# Altium project BSPD.PrjPCB (part 2 of 3)
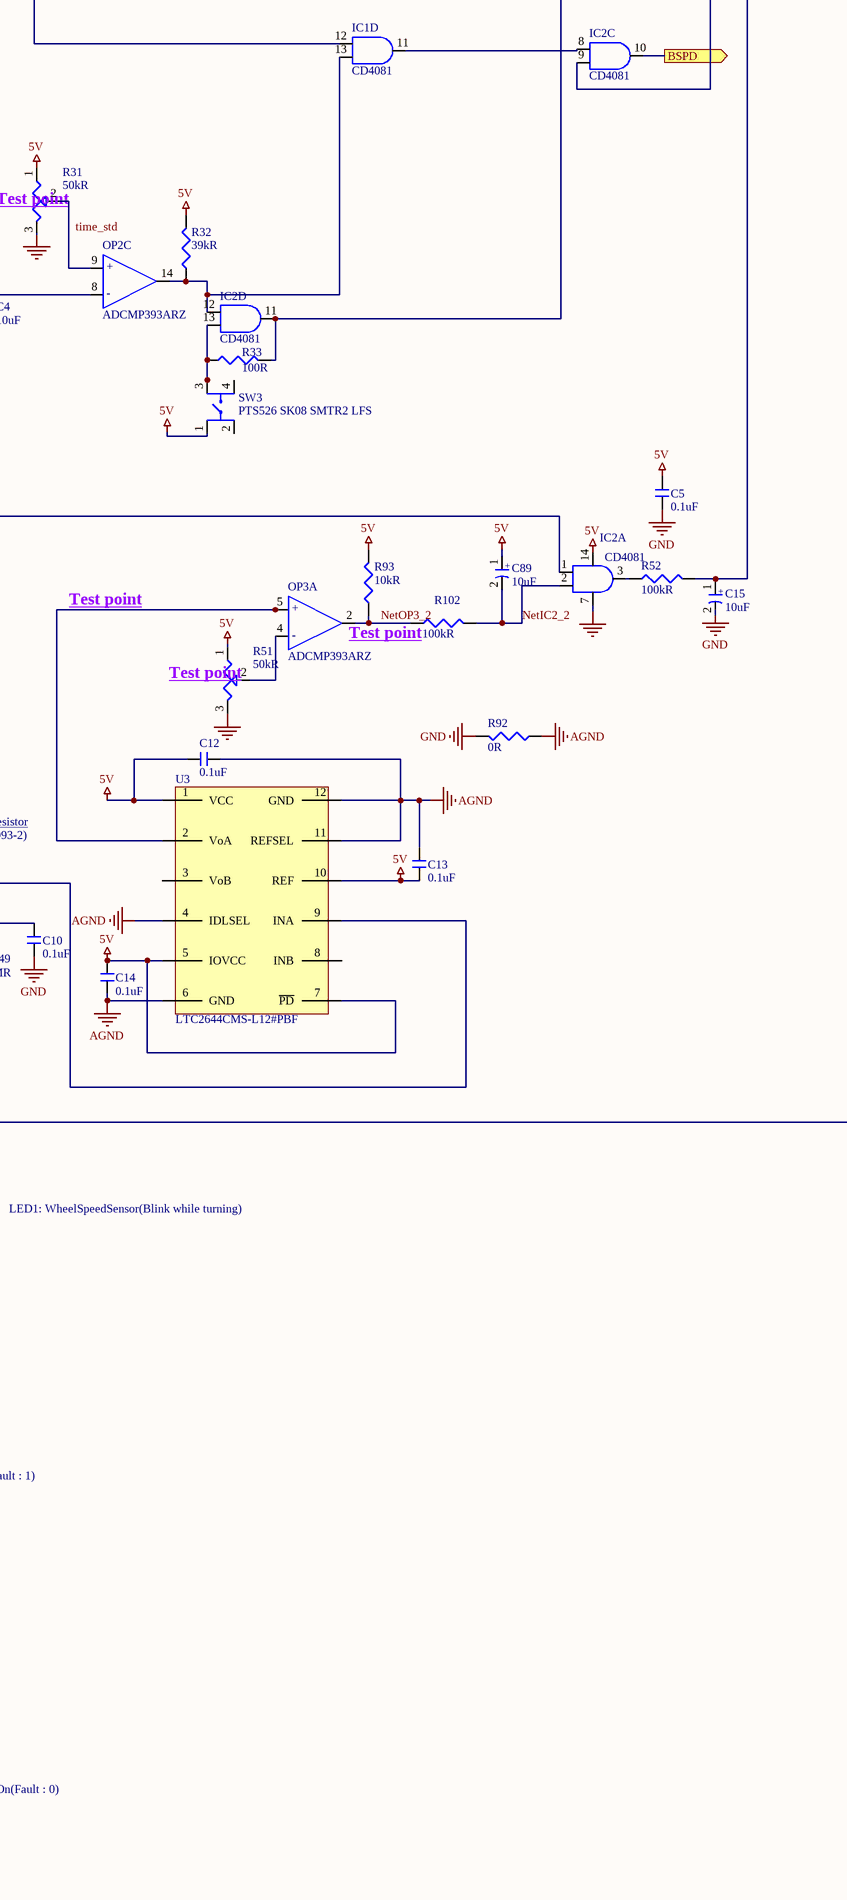
[diagram p4: BSPD+SDC.SchDoc, bottom right]

## Sheet BSPD+SDC.SchDoc (continued)
### Library data of the parts
C1 C2 C5 C6 C9 C10 C12-C14 C18-C20 C23-C26 Copt1 = 0.1uF-C0805C104M5RACTU: Cap Ceramic 0.1uF 50V X7R 10% Pad SMD 0603 Flexible Termination 125C Automotive; Manufacturer: KEMET; Manufacturer Part Number: C0603X104K5RAC3316; Supplier 1: Mouser; Supplier Part Number 1: 80-C0603X104K5R3316; Stock 1: 9731; Pricing 1: 1 = 0.19000, 10 = 0.12700, 100 = 0.06400, 500 = 0.04400, 1000 = 0.03800, 4000 = 0.03700 (USD); ComponentLink1URL: https://www.mouser.tw/ProductDetail/KEMET/C0805C104M5RACTU?qs=VOOUd%252Bza08qHu13WgNByHQ%3D%3D; ComponentLink1Description: Mouser; ComponentLink2Description: Datasheet; ComponentLink2URL: https://www.mouser.tw/datasheet/2/212/KEM_C1002_X7R_SMD-1102033.pdf
C3 C4 C15 C89 = 6.8uF-TAJC685K050RNJ: Cap Tant Solid 6.8uF 50V C CASE 10% (6 X 3.2 X 2.6mm) Inward L SMD 6032-28 1 Ohm 125C T/R; Manufacturer: AVX; Dielectric Material: Tantalum; ESR (Equivalent Series Resistance): 1R; Leakage Current: 3.4uA; Polarity: Polar; Dissipation Factor: 6%; Supplier 1: Mouser; Supplier Part Number 1: 581-TAJC685K050RNJ; Manufacturer Part Number: TAJC685K050RNJ; Stock 1: 13768; Pricing 1: 1 = 1.27000, 10 = 0.96300, 100 = 0.75300, 500 = 0.49500, 1000 = 0.43600, 2500 = 0.42200 (USD); Mount: Surface Mount; Case/Package: Molded; Weight: 0.005291oz; Case Code (Metric): 6032; Case Code (Imperial): 2312; Min Operating Temperature: -55°C; Max Operating Temperature: 125°C; Capacitance: 6.8uF; Tolerance: 10%; Voltage Rating: 50V; Packaging: Tape and Reel; Package Quantity: 1; Termination: SMD/SMT; Voltage Rating (DC): 50V; Features: General Purpose; Length: 6mm; Height: 2.8mm; Width: 0.126inch; Height - Seated (Max): 0.11inch; Depth: 3.2mm; Radiation Hardening: No; REACH SVHC: No SVHC; Lead Free: Lead Free; ComponentLink1URL: https://datasheet.ciiva.com/267/taj-267945.pdf?src-supplier=Digi-Key; ComponentLink1Description: https://datasheet.ciiva.com/267/taj-267945.pdf?src-supplier=Digi-Key; ComponentLink2URL: https://datasheet.ciiva.com/267/taj-267946.pdf?src-supplier=Digi-Key; ComponentLink2Description: https://datasheet.ciiva.com/267/taj-267946.pdf?src-supplier=Digi-Key; ComponentLink3URL: https://datasheet.ciiva.com/267/taj-267947.pdf?src-supplier=Digi-Key; ComponentLink3Description: https://datasheet.ciiva.com/267/taj-267947.pdf?src-supplier=Digi-Key; ComponentLink4URL: https://datasheet.ciiva.com/12910/taj-27497-12910591.pdf?src-supplier=Mouser; ComponentLink4Description: https://datasheet.ciiva.com/12910/taj-27497-12910591.pdf?src-supplier=Mouser; ComponentLink5URL: https://datasheet.ciiva.com/17338/taj-17338791.pdf?src-supplier=Avnet+Europe; ComponentLink5Description: https://datasheet.ciiva.com/17338/taj-17338791.pdf?src-supplier=Avnet+Europe; ComponentLink6URL: http://datasheet.octopart.com/TAJC685K050RNJ-AVX-datasheet-50868559.pdf?src-supplier=AVX; ComponentLink6Description: http://datasheet.octopart.com/TAJC685K050RNJ-AVX-datasheet-50868559.pdf?src-supplier=AVX; ComponentLink7URL: http://datasheet.octopart.com/TAJC685K050RNJ-AVX-datasheet-5313859.pdf?src-supplier=Element14; ComponentLink7Description: http://datasheet.octopart.com/TAJC685K050RNJ-AVX-datasheet-5313859.pdf?src-supplier=Element14; ComponentLink8URL: http://datasheet.octopart.com/TAJC685K050RNJ-AVX-datasheet-78694144.pdf?src-supplier=Element14; ComponentLink8Description: http://datasheet.octopart.com/TAJC685K050RNJ-AVX-datasheet-78694144.pdf?src-supplier=Element14; ComponentLink9URL: http://datasheet.octopart.com/TAJC685K050RNJ-AVX-Interconnect---Elco-datasheet-8359467.pdf; ComponentLink9Description: http://datasheet.octopart.com/TAJC685K050RNJ-AVX-Interconnect---Elco-datasheet-8359467.pdf; ComponentLink10URL: http://datasheet.octopart.com/TAJC685K050RNJ-AVX-Interconnect---Elco-datasheet-8398506.pdf; ComponentLink10Description: http://datasheet.octopart.com/TAJC685K050RNJ-AVX-Interconnect---Elco-datasheet-8398506.pdf; ComponentLink11URL: http://datasheet.octopart.com/TAJC685K050RNJ-AVX-Interconnect---Elco-datasheet-12511273.pdf; ComponentLink11Description: http://datasheet.octopart.com/TAJC685K050RNJ-AVX-Interconnect---Elco-datasheet-12511273.pdf; ComponentLink12URL: http://datasheet.octopart.com/TAJC685K050RNJ-AVX-Interconnect---Elco-datasheet-5308206.pdf?src-supplier=Factory+Futures; ComponentLink12Description: http://datasheet.octopart.com/TAJC685K050RNJ-AVX-Interconnect---Elco-datasheet-5308206.pdf?src-supplier=Factory+Futures; ComponentLink13URL: http://datasheet.octopart.com/TAJC685K050RNJ-AVX-Interconnect---Elco-datasheet-5393561.pdf?src-supplier=Factory+Futures; ComponentLink13Description: http://datasheet.octopart.com/TAJC685K050RNJ-AVX-Interconnect---Elco-datasheet-5393561.pdf?src-supplier=Factory+Futures; ComponentLink14URL: http://datasheet.octopart.com/TAJC685K050RNJ-AVX-Interconnect---Elco-datasheet-5428838.pdf?src-supplier=Factory+Futures; ComponentLink14Description: http://datasheet.octopart.com/TAJC685K050RNJ-AVX-Interconnect---Elco-datasheet-5428838.pdf?src-supplier=Factory+Futures; ComponentLink15URL: http://datasheet.octopart.com/TAJC685K050RNJ-AVX-Interconnect---Elco-datasheet-8324253.pdf?src-supplier=Factory+Futures; ComponentLink15Description: http://datasheet.octopart.com/TAJC685K050RNJ-AVX-Interconnect---Elco-datasheet-8324253.pdf?src-supplier=Factory+Futures; ComponentLink16URL: http://datasheet.octopart.com/TAJC685K050RNJ-AVX-Interconnect---Elco-datasheet-8447299.pdf?src-supplier=Factory+Futures; ComponentLink16Description: http://datasheet.octopart.com/TAJC685K050RNJ-AVX-Interconnect---Elco-datasheet-8447299.pdf?src-supplier=Factory+Futures; ComponentLink17URL: http://datasheet.octopart.com/TAJC685K050RNJ-AVX-Interconnect---Elco-datasheet-8621976.pdf?src-supplier=Factory+Futures; ComponentLink17Description: http://datasheet.octopart.com/TAJC685K050RNJ-AVX-Interconnect---Elco-datasheet-8621976.pdf?src-supplier=Factory+Futures; ComponentLink18URL: http://datasheet.octopart.com/TAJC685K050RNJ-AVX-Interconnect---Elco-datasheet-8701730.pdf?src-supplier=Factory+Futures; ComponentLink18Description: http://datasheet.octopart.com/TAJC685K050RNJ-AVX-Interconnect---Elco-datasheet-8701730.pdf?src-supplier=Factory+Futures; ComponentLink19URL: http://datasheet.octopart.com/TAJC685K050RNJ-AVX-Interconnect---Elco-datasheet-8715220.pdf?src-supplier=Factory+Futures; ComponentLink19Description: http://datasheet.octopart.com/TAJC685K050RNJ-AVX-Interconnect---Elco-datasheet-8715220.pdf?src-supplier=Factory+Futures; ComponentLink20URL: http://datasheet.octopart.com/TAJC685K050RNJ-AVX-Interconnect---Elco-datasheet-8836325.pdf?src-supplier=Factory+Futures; ComponentLink20Description: http://datasheet.octopart.com/TAJC685K050RNJ-AVX-Interconnect---Elco-datasheet-8836325.pdf?src-supplier=Factory+Futures; ComponentLink21URL: http://datasheet.octopart.com/TAJC685K050RNJ-AVX-Interconnect---Elco-datasheet-8853265.pdf?src-supplier=Factory+Futures; ComponentLink21Description: http://datasheet.octopart.com/TAJC685K050RNJ-AVX-Interconnect---Elco-datasheet-8853265.pdf?src-supplier=Factory+Futures; ComponentLink22URL: http://datasheet.octopart.com/TAJC685K050RNJ-AVX-Interconnect---Elco-datasheet-8858887.pdf?src-supplier=Factory+Futures; ComponentLink22Description: http://datasheet.octopart.com/TAJC685K050RNJ-AVX-Interconnect---Elco-datasheet-8858887.pdf?src-supplier=Factory+Futures; ComponentLink23URL: http://datasheet.octopart.com/TAJC685K050RNJ-AVX-Interconnect---Elco-datasheet-8877386.pdf?src-supplier=Factory+Futures; ComponentLink23Description: http://datasheet.octopart.com/TAJC685K050RNJ-AVX-Interconnect---Elco-datasheet-8877386.pdf?src-supplier=Factory+Futures; ComponentLink24URL: http://datasheet.octopart.com/TAJC685K050RNJ-AVX-Interconnect---Elco-datasheet-10028080.pdf?src-supplier=Factory+Futures; ComponentLink24Description: http://datasheet.octopart.com/TAJC685K050RNJ-AVX-Interconnect---Elco-datasheet-10028080.pdf?src-supplier=Factory+Futures; ComponentLink25URL: http://datasheet.octopart.com/TAJC685K050RNJ-AVX-Interconnect---Elco-datasheet-10193294.pdf?src-supplier=Factory+Futures; ComponentLink25Description: http://datasheet.octopart.com/TAJC685K050RNJ-AVX-Interconnect---Elco-datasheet-10193294.pdf?src-supplier=Factory+Futures; ComponentLink26URL: http://datasheet.octopart.com/TAJC685K050RNJ-AVX-Interconnect---Elco-datasheet-10285639.pdf?src-supplier=Factory+Futures; ComponentLink26Description: http://datasheet.octopart.com/TAJC685K050RNJ-AVX-Interconnect---Elco-datasheet-10285639.pdf?src-supplier=Factory+Futures; ComponentLink27URL: http://datasheet.octopart.com/TAJC685K050RNJ-AVX-Interconnect---Elco-datasheet-10380087.pdf?src-supplier=Factory+Futures; ComponentLink27Description: http://datasheet.octopart.com/TAJC685K050RNJ-AVX-Interconnect---Elco-datasheet-10380087.pdf?src-supplier=Factory+Futures; ComponentLink28URL: http://datasheet.octopart.com/TAJC685K050RNJ-AVX-Interconnect---Elco-datasheet-10403705.pdf?src-supplier=Factory+Futures; ComponentLink28Description: http://datasheet.octopart.com/TAJC685K050RNJ-AVX-Interconnect---Elco-datasheet-10403705.pdf?src-supplier=Factory+Futures; ComponentLink29URL: http://datasheet.octopart.com/TAJC685K050RNJ-AVX-Interconnect---Elco-datasheet-10545425.pdf?src-supplier=Factory+Futures; ComponentLink29Description: http://datasheet.octopart.com/TAJC685K050RNJ-AVX-Interconnect---Elco-datasheet-10545425.pdf?src-supplier=Factory+Futures; ComponentLink30URL: http://datasheet.octopart.com/TAJC685K050RNJ-AVX-Interconnect---Elco-datasheet-10620092.pdf?src-supplier=Factory+Futures; ComponentLink30Description: http://datasheet.octopart.com/TAJC685K050RNJ-AVX-Interconnect---Elco-datasheet-10620092.pdf?src-supplier=Factory+Futures; ComponentLink31URL: http://datasheet.octopart.com/TAJC685K050RNJ-AVX-Interconnect---Elco-datasheet-10839255.pdf?src-supplier=Factory+Futures; ComponentLink31Description: http://datasheet.octopart.com/TAJC685K050RNJ-AVX-Interconnect---Elco-datasheet-10839255.pdf?src-supplier=Factory+Futures; ComponentLink32URL: http://datasheet.octopart.com/TAJC685K050RNJ-AVX-Interconnect---Elco-datasheet-10851837.pdf?src-supplier=Factory+Futures; ComponentLink32Description: http://datasheet.octopart.com/TAJC685K050RNJ-AVX-Interconnect---Elco-datasheet-10851837.pdf?src-supplier=Factory+Futures; ComponentLink33URL: http://datasheet.octopart.com/TAJC685K050RNJ-AVX-Interconnect---Elco-datasheet-10916590.pdf?src-supplier=Factory+Futures; ComponentLink33Description: http://datasheet.octopart.com/TAJC685K050RNJ-AVX-Interconnect---Elco-datasheet-10916590.pdf?src-supplier=Factory+Futures; ComponentLink34URL: http://datasheet.octopart.com/TAJC685K050RNJ-AVX-Interconnect---Elco-datasheet-11475269.pdf?src-supplier=Factory+Futures; ComponentLink34Description: http://datasheet.octopart.com/TAJC685K050RNJ-AVX-Interconnect---Elco-datasheet-11475269.pdf?src-supplier=Factory+Futures; ComponentLink35URL: http://datasheet.octopart.com/TAJC685K050RNJ-AVX-datasheet-48507738.pdf?src-supplier=Future+Electronics; ComponentLink35Description: http://datasheet.octopart.com/TAJC685K050RNJ-AVX-datasheet-48507738.pdf?src-supplier=Future+Electronics; ComponentLink36URL: http://datasheet.octopart.com/TAJC685K050RNJ-AVX-datasheet-66442782.pdf?src-supplier=Newark; ComponentLink36Description: http://datasheet.octopart.com/TAJC685K050RNJ-AVX-datasheet-66442782.pdf?src-supplier=Newark; ComponentLink37URL: http://datasheet.octopart.com/TAJC685K050RNJ-AVX-datasheet-62304617.pdf?src-supplier=Farnell; ComponentLink37Description: http://datasheet.octopart.com/TAJC685K050RNJ-AVX-datasheet-62304617.pdf?src-supplier=Farnell; ComponentLink38URL: http://datasheet.octopart.com/TAJ-Series---Standard-Tantalum-AVX-datasheet-family-88.pdf; ComponentLink38Description: http://datasheet.octopart.com/TAJ-Series---Standard-Tantalum-AVX-datasheet-family-88.pdf
C7 C11 = 1206 100nF (104) 10% 50V: 贴片电容; Package: 1206; Supplier: LC; SuppliersPartNumber: C24497
  C11: ComponentLink1Description: 供应商链接; ComponentLink1URL: http://www.szlcsc.com/product/details_25237.html
C8 = 1206 470pF (471) 10% 50V: 贴片电容; ComponentLink1Description: 供应商链接; ComponentLink1URL: http://www.szlcsc.com/product/details_2220.html; Package: 1206; Supplier: LC; SuppliersPartNumber: C1868
C16 = 1uF-0805DC105KAT2A: Cap Cer 0805 1uF 25V X7R 10%; Manufacturer: KEMET; Manufacturer Part Number: C0805C474K3REC7210; Supplier 1: Mouser; Stock 1: 9935; Pricing 1: 1 = 0.30000, 10 = 0.14000, 100 = 0.09000, 500 = 0.08000, 1000 = 0.07000, 2000 = 0.06000 (USD); Supplier Part Number 1: 80-C0805C474K3RECLR; ComponentLink2Description: Mouser; ComponentLink2URL: https://www.mouser.tw/ProductDetail/AVX/0805DC105KAT2A?qs=ZBeOGGPQgEHtAr%2F2DCpkLA%3D%3D
C17 = 0.47uF-C0805C474K3REC7210: Cap Cer 0805 470NF 25V X7R 10%; Manufacturer: KEMET; Supplier 1: Mouser; Manufacturer Part Number: C0805C474K3REC7210; Stock 1: 9935; Pricing 1: 1 = 0.30000, 10 = 0.14000, 100 = 0.09000, 500 = 0.08000, 1000 = 0.07000, 2000 = 0.06000 (USD); ComponentLink1URL: https://api.kemet.com/component-edge/download/datasheet/C0805C474K3REC7210.pdf?src-supplier=Digi-Key; ComponentLink1Description: https://api.kemet.com/component-edge/download/datasheet/C0805C474K3REC7210.pdf?src-supplier=Digi-Key; Supplier Part Number 1: 80-C0805C474K3RECLR
C27 = UPM1J221MHD1TO: Cap Aluminum 220uF 63V 20% (12.5 X 20mm) Radial 7.5mm 835mA 5000h 105°C Ammo Pack; Manufacturer: Nichicon; Dielectric Material: Aluminium; Impedance: 65mR; Life (Hours): 5000Hour; Leakage Current: 415.8uA; Dissipation Factor: 0.08%; Lead Diameter: 0.6mm; Supplier 1: Mouser; Supplier Part Number 1: 647-UPM1J221MHD1TO; Manufacturer Part Number: UPM1J221MHD1TO; Stock 1: 485; Pricing 1: 1 = 0.84000, 10 = 0.63700, 50 = 0.53000, 100 = 0.45600, 1000 = 0.30300, 10000 = 0.26900 (USD); Mount: Through Hole; Case/Package: Radial; Number of Pins: 2; Min Operating Temperature: -55°C; Max Operating Temperature: 105°C; Capacitance: 220uF; Tolerance: 20%; Voltage Rating: 63V; Ripple Current: 835mA; Package Quantity: 1; Packaging: Tape and Reel; Voltage Rating (DC): 63V; Termination: Radial; Voltage: 63V; Series: PM; Construction: RADIAL; Diameter: 12.5mm; Length: 20mm; Height: 20mm; Lead Pitch: 5mm; Height - Seated (Max): 0.866inch; Radiation Hardening: No; REACH SVHC: No SVHC; Lead Free: Lead Free; RoHS Compliant: Yes; ComponentLink1URL: https://datasheet.ciiva.com/6136/e-pm-6136976.pdf?src-supplier=Farnell; ComponentLink1Description: https://datasheet.ciiva.com/6136/e-pm-6136976.pdf?src-supplier=Farnell; ComponentLink2URL: https://datasheet.ciiva.com/16289/e-pm-16289237.pdf?src-supplier=Future+Electronics; ComponentLink2Description: https://datasheet.ciiva.com/16289/e-pm-16289237.pdf?src-supplier=Future+Electronics; ComponentLink3URL: https://datasheet.ciiva.com/29547/e-pm-29547336.pdf?src-supplier=Digi-Key; ComponentLink3Description: https://datasheet.ciiva.com/29547/e-pm-29547336.pdf?src-supplier=Digi-Key; ComponentLink4URL: https://datasheet.ciiva.com/14604/70187696-14604329.pdf?src-supplier=Allied+Electronics; ComponentLink4Description: https://datasheet.ciiva.com/14604/70187696-14604329.pdf?src-supplier=Allied+Electronics; ComponentLink5URL: https://datasheet.ciiva.com/29547/e-pm-29547337.pdf?src-supplier=Digi-Key; ComponentLink5Description: https://datasheet.ciiva.com/29547/e-pm-29547337.pdf?src-supplier=Digi-Key; ComponentLink6URL: https://datasheet.ciiva.com/7907/e-pm-7907421.pdf?src-supplier=Element14; ComponentLink6Description: https://datasheet.ciiva.com/7907/e-pm-7907421.pdf?src-supplier=Element14; ComponentLink7URL: https://datasheet.ciiva.com/11684/e-pm-11684319.pdf?src-supplier=Avnet; ComponentLink7Description: https://datasheet.ciiva.com/11684/e-pm-11684319.pdf?src-supplier=Avnet; ComponentLink8URL: http://datasheet.octopart.com/UPM1J221MHD1TO-Nichicon-datasheet-8702619.pdf?src-supplier=Element14; ComponentLink8Description: http://datasheet.octopart.com/UPM1J221MHD1TO-Nichicon-datasheet-8702619.pdf?src-supplier=Element14; ComponentLink9URL: http://datasheet.octopart.com/UPM1J221MHD1TO-Nichicon-datasheet-41194115.pdf?src-supplier=Farnell; ComponentLink9Description: http://datasheet.octopart.com/UPM1J221MHD1TO-Nichicon-datasheet-41194115.pdf?src-supplier=Farnell; ComponentLink10URL: http://datasheet.octopart.com/UPM1J221MHD1TO-Nichicon-datasheet-12512882.pdf?src-supplier=Element14; ComponentLink10Description: http://datasheet.octopart.com/UPM1J221MHD1TO-Nichicon-datasheet-12512882.pdf?src-supplier=Element14; ComponentLink11URL: http://datasheet.octopart.com/UPM1J221MHD1TO-Nichicon-datasheet-8835184.pdf?src-supplier=Element14; ComponentLink11Description: http://datasheet.octopart.com/UPM1J221MHD1TO-Nichicon-datasheet-8835184.pdf?src-supplier=Element14; ComponentLink12URL: http://datasheet.octopart.com/UPM1J221MHD1TO-Nichicon-datasheet-538736.pdf?src-supplier=Future+Electronics; ComponentLink12Description: http://datasheet.octopart.com/UPM1J221MHD1TO-Nichicon-datasheet-538736.pdf?src-supplier=Future+Electronics; ComponentLink13URL: http://datasheet.octopart.com/UPM1J221MHD1TO-Nichicon-datasheet-5316055.pdf?src-supplier=Element14; ComponentLink13Description: http://datasheet.octopart.com/UPM1J221MHD1TO-Nichicon-datasheet-5316055.pdf?src-supplier=Element14; ComponentLink14URL: http://datasheet.octopart.com/UPM1J221MHD1TO-Nichicon-datasheet-41169139.pdf?src-supplier=Element14; ComponentLink14Description: http://datasheet.octopart.com/UPM1J221MHD1TO-Nichicon-datasheet-41169139.pdf?src-supplier=Element14
D1-D6 D10-D13 = 1N4148W-TP: 1N4148W Series 100 V 150 mA 4 ns SMT High Speed Switching Diode - SOD-123; Manufacturer: MCC; Max Surge Current: 2A; Forward Voltage: 1V; Forward Current: 150mA; Recovery Time: 4ns; Max Reverse Leakage Current: 5uA; Max Repetitive Reverse Voltage (Vrrm): 100V; Power Dissipation: 400mW; Max Forward Surge Current (Ifsm): 1A; Element Configuration: Single; Polarity: Standard; Capacitance: 4pF; Supplier 1: Digi-Key; Supplier Part Number 1: 1N4148WTPMSCT-ND; Manufacturer Part Number: 1N4148W-TP; Stock 1: 726390; Pricing 1: 1 = 0.10000, 10 = 0.08100, 100 = 0.03400, 500 = 0.02670, 1000 = 0.01854 (USD); Mount: Surface Mount; Number of Pins: 2; Min Operating Temperature: -65°C; Max Operating Temperature: 150°C; Packaging: Tape and Reel; Package Quantity: 3000; Average Rectified Current: 150mA; Reverse Recovery Time: 4ns; Peak Non-Repetitive Surge Current: 2A; Voltage Rating (DC): 100V; Current Rating: 150mA; Output Current: 150mA; Max Reverse Voltage (DC): 100V; Length: 2.85mm; Height: 1.2mm; Width: 1.8mm; Radiation Hardening: No; REACH SVHC: Unknown; Lead Free: Lead Free; ComponentLink1URL: https://datasheet.ciiva.com/1243/1684829-1243908.pdf?src-supplier=Newark; ComponentLink1Description: https://datasheet.ciiva.com/1243/1684829-1243908.pdf?src-supplier=Newark; ComponentLink2URL: https://datasheet.ciiva.com/16836/1n4148wsod123-16836277.pdf?src-supplier=Future+Electronics; ComponentLink2Description: https://datasheet.ciiva.com/16836/1n4148wsod123-16836277.pdf?src-supplier=Future+Electronics; ComponentLink3URL: https://datasheet.ciiva.com/4435/1n4148wsod123-48460-4435223.pdf?src-supplier=Mouser; ComponentLink3Description: https://datasheet.ciiva.com/4435/1n4148wsod123-48460-4435223.pdf?src-supplier=Mouser; ComponentLink4URL: https://datasheet.ciiva.com/14557/70055519-14557767.pdf?src-supplier=Allied+Electronics; ComponentLink4Description: https://datasheet.ciiva.com/14557/70055519-14557767.pdf?src-supplier=Allied+Electronics; ComponentLink5URL: https://datasheet.ciiva.com/911/1n4148wsod123-911676.pdf?src-supplier=Digi-Key; ComponentLink5Description: https://datasheet.ciiva.com/911/1n4148wsod123-911676.pdf?src-supplier=Digi-Key; ComponentLink6URL: https://datasheet.ciiva.com/7622/1684829-7622556.pdf?src-supplier=Element14; ComponentLink6Description: https://datasheet.ciiva.com/7622/1684829-7622556.pdf?src-supplier=Element14; ComponentLink7URL: https://datasheet.ciiva.com/911/1n4148wsod123-911677.pdf?src-supplier=Digi-Key; ComponentLink7Description: https://datasheet.ciiva.com/911/1n4148wsod123-911677.pdf?src-supplier=Digi-Key; ComponentLink8URL: https://datasheet.ciiva.com/911/1n4148wsod123-911678.pdf?src-supplier=Digi-Key; ComponentLink8Description: https://datasheet.ciiva.com/911/1n4148wsod123-911678.pdf?src-supplier=Digi-Key; ComponentLink9URL: https://datasheet.ciiva.com/22747/1684829-22747439.pdf?src-supplier=Element14; ComponentLink9Description: https://datasheet.ciiva.com/22747/1684829-22747439.pdf?src-supplier=Element14; ComponentLink10URL: http://datasheet.octopart.com/1N4148W-TP-Micro-Commercial-datasheet-60845.pdf?src-supplier=Element14; ComponentLink10Description: http://datasheet.octopart.com/1N4148W-TP-Micro-Commercial-datasheet-60845.pdf?src-supplier=Element14; ComponentLink11URL: http://datasheet.octopart.com/1N4148W-TP-MCC-datasheet-8327246.pdf?src-supplier=Future+Electronics; ComponentLink11Description: http://datasheet.octopart.com/1N4148W-TP-MCC-datasheet-8327246.pdf?src-supplier=Future+Electronics; ComponentLink12URL: http://datasheet.octopart.com/1N4148W-TP-MCC-datasheet-124568.pdf?src-supplier=Future+Electronics; ComponentLink12Description: http://datasheet.octopart.com/1N4148W-TP-MCC-datasheet-124568.pdf?src-supplier=Future+Electronics; ComponentLink13URL: http://datasheet.octopart.com/1N4148W-TP-MCC-datasheet-10003094.pdf?src-supplier=Allied+Electronics; ComponentLink13Description: http://datasheet.octopart.com/1N4148W-TP-MCC-datasheet-10003094.pdf?src-supplier=Allied+Electronics; ComponentLink14URL: http://datasheet.octopart.com/1N4148W-TP-Micro-Commercial-datasheet-11773887.pdf?src-supplier=Arrow; ComponentLink14Description: http://datasheet.octopart.com/1N4148W-TP-Micro-Commercial-datasheet-11773887.pdf?src-supplier=Arrow; ComponentLink15URL: http://datasheet.octopart.com/1N4148W-TP-Micro-Commercial-datasheet-13551187.pdf?src-supplier=Future+Electronics; ComponentLink15Description: http://datasheet.octopart.com/1N4148W-TP-Micro-Commercial-datasheet-13551187.pdf?src-supplier=Future+Electronics; ComponentLink16URL: http://datasheet.octopart.com/1N4148W-TP-MCC-datasheet-133511570.pdf?src-supplier=Future+Electronics; ComponentLink16Description: http://datasheet.octopart.com/1N4148W-TP-MCC-datasheet-133511570.pdf?src-supplier=Future+Electronics; ComponentLink17URL: http://datasheet.octopart.com/1N4148W-TP-MCC-datasheet-134792309.pdf?src-supplier=TME; ComponentLink17Description: http://datasheet.octopart.com/1N4148W-TP-MCC-datasheet-134792309.pdf?src-supplier=TME; Supplier 2: Mouser; Supplier Part Number 2: 833-1N4148W-TP
D7-D9 = 1SS355VMFHTE-17: ROHM         1SS355VMFHTE-17             Small Signal Diode, Single, 90 V, 100 mA, 1.2 V, 4 ns, 500 mA; Max Repetitive Reverse Voltage (Vrrm): 90V; Forward Current: 100mA; Forward Voltage: 1.2V; Reverse Recovery Time: 4ns; Max Forward Surge Current (Ifsm): 500mA; Supplier 1: Mouser; Supplier Part Number 1: 755-1SS355VMFHTE-17; Manufacturer: Rohm; Manufacturer Part Number: 1SS355VMFHTE-17; RoHS: No; Stock 1: 46949; Pricing 1: 1 = 0.31000, 10 = 0.21200, 100 = 0.08900, 1000 = 0.06000, 3000 = 0.04700, 9000 = 0.04700 (USD); Case/Package: SOD; Number of Pins: 2; Max Operating Temperature: 150°C; Packaging: Cut Tape; Element Configuration: Single; REACH SVHC: Unknown; ComponentLink1URL: http://www.farnell.com/datasheets/2296360.pdf?src-supplier=Farnell; ComponentLink1Description: http://www.farnell.com/datasheets/2296360.pdf?src-supplier=Farnell; ComponentLink2URL: http://www.farnell.com/datasheets/2021474.pdf?src-supplier=Farnell; ComponentLink2Description: http://www.farnell.com/datasheets/2021474.pdf?src-supplier=Farnell; ComponentLink3URL: https://www.rohm.com/datasheet/1SS355VMFH/1ss355vmfhte-17-e?src-supplier=Digi-Key; ComponentLink3Description: https://www.rohm.com/datasheet/1SS355VMFH/1ss355vmfhte-17-e?src-supplier=Digi-Key; ComponentLink4URL: http://www.farnell.com/datasheets/2296360.pdf?src-supplier=Newark; ComponentLink4Description: http://www.farnell.com/datasheets/2296360.pdf?src-supplier=Newark; ComponentLink5URL: http://www.farnell.com/datasheets/2021474.pdf?src-supplier=Element14; ComponentLink5Description: http://www.farnell.com/datasheets/2021474.pdf?src-supplier=Element14; catagory: diode
H1 = 34830-2002: MX150 2x10 Dual Row Right-Angle Header, 20 Circuits, Keying Option B, Light Gray, Solder Tail; Manufacturer: Molex; Gender: Male; Number of Circuits: 20; Pitch: 3.5mm; Glow Wire Compliant: Non-compliant; Supplier 1: Mouser; Supplier Part Number 1: 538-34830-2002; Manufacturer Part Number: 34830-2002; Stock 1: 153; Pricing 1: 1 = 8.15000, 10 = 7.09000, 50 = 7.09000, 100 = 5.85000, 1000 = 5.21000, 10000 = 5.21000 (USD); Mount: Through Hole; Number of Pins: 20; Material: Copper Alloy; Contact Plating: Nickel; Packaging: Tray; Orientation: Right Angle; Number of Rows: 2; Termination: Solder; Halogen Free: Low Halogen; ELV: Compliant; ComponentLink1URL: http://datasheet.octopart.com/34830-2002-Molex-datasheet-16362846.pdf?src-supplier=Molex; ComponentLink1Description: http://datasheet.octopart.com/34830-2002-Molex-datasheet-16362846.pdf?src-supplier=Molex; ComponentLink2URL: http://sigma.octopart.com/16362845/technical_drawing/Molex-34830-2002.pdf?src-supplier=Molex; ComponentLink2Description: http://sigma.octopart.com/16362845/technical_drawing/Molex-34830-2002.pdf?src-supplier=Molex
H2 = 34830-0801: MX150 2x4 Dual Row Right-Angle Header, 8 Circuits, Keying Option A, Black, Solder Tail; Manufacturer: Molex; Gender: Male; Number of Circuits: 8; Pitch: 3.5mm; Glow Wire Compliant: Non-compliant; Supplier 1: Mouser; Supplier Part Number 1: 538-34830-0801; Manufacturer Part Number: 34830-0801; Stock 1: 31; Pricing 1: 1 = 4.90000, 10 = 4.32000, 50 = 4.32000, 100 = 3.44000, 1000 = 2.89000, 10000 = 2.80000 (USD); Mount: Through Hole; Material: Copper Alloy; Contact Plating: Nickel; Termination: Solder; Packaging: Tray; Orientation: Right Angle; Number of Rows: 2; Halogen Free: Low Halogen; ELV: Compliant; ComponentLink1URL: http://datasheet.octopart.com/34830-0801-Molex-datasheet-16362832.pdf?src-supplier=Molex; ComponentLink1Description: http://datasheet.octopart.com/34830-0801-Molex-datasheet-16362832.pdf?src-supplier=Molex; ComponentLink2URL: http://sigma.octopart.com/16362835/technical_drawing/Molex-34830-0801.pdf?src-supplier=Molex; ComponentLink2Description: http://sigma.octopart.com/16362835/technical_drawing/Molex-34830-0801.pdf?src-supplier=Molex; ComponentLink3URL: http://datasheet.octopart.com/34830-0801-Molex-datasheet-120147758.pdf?src-supplier=Allied+Electronics; ComponentLink3Description: http://datasheet.octopart.com/34830-0801-Molex-datasheet-120147758.pdf?src-supplier=Allied+Electronics; ComponentLink4URL: http://datasheet.octopart.com/34830-0801-Molex-datasheet-140182486.pdf?src-supplier=Allied+Electronics; ComponentLink4Description: http://datasheet.octopart.com/34830-0801-Molex-datasheet-140182486.pdf?src-supplier=Allied+Electronics
H3 = 0367831201: MX120G Sealed Header Connector Assembly, 12 Circuit, Color Mark Identification Black; Manufacturer: Molex; Number of Positions: 12; Connector Type: Male Pin; Pitch: 0.126inch; Row Spacing: 0.233inch; Supplier 1: Mouser; Supplier Part Number 1: 538-36783-1201; Manufacturer Part Number: 0367831201; Stock 1: 569; Pricing 1: 1 = 1.45000, 10 = 1.20000, 50 = 1.20000, 100 = 1.05000, 1000 = 0.81300, 10000 = 0.65700 (USD); Mount: Through Hole; Color: Black; Contact Plating: Tin; Contact Material: Brass; Housing Color: Black; Housing Material: Nylon; Min Operating Temperature: -40°C; Max Operating Temperature: 105°C; Number of Rows: 2; Fastening Type: Ramp; Packaging: Bulk; Termination: Solder; Number of Contacts: 12; Orientation: Right Angle; Series: MX120G™ 36783; Contact Type: Male Pin; Length: 37.3mm; Radiation Hardening: No; Lead Free: Lead Free; RoHS Compliant: Yes; ComponentLink1URL: https://datasheet.ciiva.com/6814/367831201-sd-6814032.pdf?src-supplier=Digi-Key; ComponentLink1Description: https://datasheet.ciiva.com/6814/367831201-sd-6814032.pdf?src-supplier=Digi-Key; ComponentLink2URL: http://datasheet.octopart.com/0367831201-Molex-datasheet-16367546.pdf?src-supplier=Molex; ComponentLink2Description: http://datasheet.octopart.com/0367831201-Molex-datasheet-16367546.pdf?src-supplier=Molex; ComponentLink3URL: http://datasheet.octopart.com/36783-1201-Molex-datasheet-13268039.pdf?src-supplier=Molex; ComponentLink3Description: http://datasheet.octopart.com/36783-1201-Molex-datasheet-13268039.pdf?src-supplier=Molex; ComponentLink4URL: http://datasheet.octopart.com/36783-1201-Molex-datasheet-34442202.pdf?src-supplier=Farnell; ComponentLink4Description: http://datasheet.octopart.com/36783-1201-Molex-datasheet-34442202.pdf?src-supplier=Farnell; ComponentLink5URL: http://datasheet.octopart.com/36783-1201-Molex-datasheet-41568726.pdf?src-supplier=Element14; ComponentLink5Description: http://datasheet.octopart.com/36783-1201-Molex-datasheet-41568726.pdf?src-supplier=Element14; ComponentLink6URL: http://datasheet.octopart.com/36783-1201-Molex-datasheet-66628265.pdf?src-supplier=Element14; ComponentLink6Description: http://datasheet.octopart.com/36783-1201-Molex-datasheet-66628265.pdf?src-supplier=Element14; ComponentLink7URL: http://datasheet.octopart.com/36783-1201-Molex-datasheet-101582201.pdf?src-supplier=Element14; ComponentLink7Description: http://datasheet.octopart.com/36783-1201-Molex-datasheet-101582201.pdf?src-supplier=Element14; ComponentLink8URL: http://datasheet.octopart.com/36783-1201-Molex-datasheet-21320486.pdf?src-supplier=Electro+Sonic; ComponentLink8Description: http://datasheet.octopart.com/36783-1201-Molex-datasheet-21320486.pdf?src-supplier=Electro+Sonic; ComponentLink9URL: http://datasheet.octopart.com/36783-1201-Molex-datasheet-27084827.pdf?src-supplier=Electro+Sonic; ComponentLink9Description: http://datasheet.octopart.com/36783-1201-Molex-datasheet-27084827.pdf?src-supplier=Electro+Sonic; ComponentLink10URL: http://datasheet.octopart.com/36783-1201-Molex-datasheet-37169560.pdf?src-supplier=Electro+Sonic; ComponentLink10Description: http://datasheet.octopart.com/36783-1201-Molex-datasheet-37169560.pdf?src-supplier=Electro+Sonic; ComponentLink11URL: http://datasheet.octopart.com/36783-1201-Molex-datasheet-120148052.pdf?src-supplier=Allied+Electronics; ComponentLink11Description: http://datasheet.octopart.com/36783-1201-Molex-datasheet-120148052.pdf?src-supplier=Allied+Electronics; ComponentLink12URL: http://datasheet.octopart.com/36783-1201-Molex-datasheet-140182688.pdf?src-supplier=Allied+Electronics; ComponentLink12Description: http://datasheet.octopart.com/36783-1201-Molex-datasheet-140182688.pdf?src-supplier=Allied+Electronics
IC1 IC2 = CD4081BM: In a Tube of 50, Texas Instruments CD4081BM, Quad 2-Input AND Logic Gate, 14-Pin SOIC; Min Supply Voltage: 3V; Max Supply Voltage: 18V; Number of Elements: 4; Number of Outputs: 1; Quiescent Current: 5uA; High Level Output Current: -4.2mA; Low Level Output Current: 4.2mA; Output Current: 6.8mA; Number of Inputs: 2; Propagation Delay: 90ns; Turn-On Delay Time: 12ns; Schmitt Trigger Input: No; Input Capacitance: 5pF; Power Dissipation: 500mW; Supplier 1: Mouser; Supplier Part Number 1: 595-CD4081BM; Manufacturer: Texas Instruments; Manufacturer Part Number: CD4081BM; Stock 1: 2050; Pricing 1: 1 = 0.52000, 10 = 0.43300, 100 = 0.26300, 1000 = 0.20300, 2500 = 0.17300, 10000 = 0.16100 (USD); Mount: Surface Mount; Case/Package: SOIC; Number of Pins: 14; Weight: 0.004564oz; Contact Plating: Gold; Min Operating Temperature: -55°C; Max Operating Temperature: 125°C; Logic Function: AND; Packaging: Rail/Tube; Package Quantity: 50; Number of Gates: 4; Number of Circuits: 4; Number of Input Lines: 2; Number of Output Lines: 1; Number of Bits: 4; Length: 8.65mm; Height: 1.58mm; Width: 3.91mm; Radiation Hardening: No; Lead Free: Lead Free; REACH SVHC: No SVHC; ComponentLink1URL: https://datasheet.ciiva.com/1626/cd4081b-1626210.pdf?src-supplier=Newark; ComponentLink1Description: https://datasheet.ciiva.com/1626/cd4081b-1626210.pdf?src-supplier=Newark; ComponentLink2URL: https://datasheet.ciiva.com/15090/getdatasheetpartid-83085-15090610.pdf?src-supplier=Verical; ComponentLink2Description: https://datasheet.ciiva.com/15090/getdatasheetpartid-83085-15090610.pdf?src-supplier=Verical; ComponentLink3URL: https://datasheet.ciiva.com/26865/cd4081bm-26865364.pdf?src-supplier=IIIC; ComponentLink3Description: https://datasheet.ciiva.com/26865/cd4081bm-26865364.pdf?src-supplier=IIIC; ComponentLink4URL: https://datasheet.ciiva.com/41455/001015529-da-01-en-ic-2-in-and-gate-qu-cd4081bm-soic-14-tid-41455446.pdf?src-supplier=Conrad; ComponentLink4Description: https://datasheet.ciiva.com/41455/001015529-da-01-en-ic-2-in-and-gate-qu-cd4081bm-soic-14-tid-41455446.pdf?src-supplier=Conrad; ComponentLink5URL: https://datasheet.ciiva.com/1866/cd4073b-1866564.pdf?src-supplier=Digi-Key; ComponentLink5Description: https://datasheet.ciiva.com/1866/cd4073b-1866564.pdf?src-supplier=Digi-Key; ComponentLink6URL: https://datasheet.ciiva.com/7949/1833366-7949020.pdf?src-supplier=Element14; ComponentLink6Description: https://datasheet.ciiva.com/7949/1833366-7949020.pdf?src-supplier=Element14; ComponentLink7URL: https://octopart.com/click/track?ai=8629&ct=datasheets&sig=02680e7&at=physicalpart&sid=370&ppid=42573&hlid=24875867&src-supplier=TI+store; ComponentLink7Description: https://octopart.com/click/track?ai=8629&ct=datasheets&sig=02680e7&at=physicalpart&sid=370&ppid=42573&hlid=24875867&src-supplier=TI+store; ComponentLink8URL: http://datasheet.octopart.com/CD4081BM-Texas-Instruments-datasheet-151253.pdf?src-supplier=TI+store; ComponentLink8Description: http://datasheet.octopart.com/CD4081BM-Texas-Instruments-datasheet-151253.pdf?src-supplier=TI+store; ComponentLink9URL: http://datasheet.octopart.com/CD4081BM-Texas-Instruments-datasheet-10253518.pdf?src-supplier=TI+store; ComponentLink9Description: http://datasheet.octopart.com/CD4081BM-Texas-Instruments-datasheet-10253518.pdf?src-supplier=TI+store; ComponentLink10URL: http://datasheet.octopart.com/CD4081BM-Texas-Instruments-datasheet-10253444.pdf?src-supplier=TI+store; ComponentLink10Description: http://datasheet.octopart.com/CD4081BM-Texas-Instruments-datasheet-10253444.pdf?src-supplier=TI+store; ComponentLink11URL: http://datasheet.octopart.com/CD4081BM-Texas-Instruments-datasheet-10794629.pdf?src-supplier=TI+store; ComponentLink11Description: http://datasheet.octopart.com/CD4081BM-Texas-Instruments-datasheet-10794629.pdf?src-supplier=TI+store; ComponentLink12URL: http://sigma.octopart.com/49249646/technical_drawing/Texas-Instruments-CD4081BM.pdf?src-supplier=TI+store; ComponentLink12Description: http://sigma.octopart.com/49249646/technical_drawing/Texas-Instruments-CD4081BM.pdf?src-supplier=TI+store; ComponentLink13URL: http://datasheet.octopart.com/CD4081BM-Texas-Instruments-datasheet-47642733.pdf?src-supplier=Farnell; ComponentLink13Description: http://datasheet.octopart.com/CD4081BM-Texas-Instruments-datasheet-47642733.pdf?src-supplier=Farnell; ComponentLink14URL: http://datasheet.octopart.com/CD4081BM-Texas-Instruments-datasheet-5313817.pdf?src-supplier=Newark; ComponentLink14Description: http://datasheet.octopart.com/CD4081BM-Texas-Instruments-datasheet-5313817.pdf?src-supplier=Newark; ComponentLink15URL: http://datasheet.octopart.com/CD4081BM-Texas-Instruments-datasheet-8372246.pdf?src-supplier=Newark; ComponentLink15Description: http://datasheet.octopart.com/CD4081BM-Texas-Instruments-datasheet-8372246.pdf?src-supplier=Newark; ComponentLink16URL: http://datasheet.octopart.com/CD4081BM-Texas-Instruments-datasheet-32637.pdf?src-supplier=Newark; ComponentLink16Description: http://datasheet.octopart.com/CD4081BM-Texas-Instruments-datasheet-32637.pdf?src-supplier=Newark; ComponentLink17URL: http://datasheet.octopart.com/CD4081BM-Texas-Instruments-datasheet-5254.pdf?src-supplier=Allied+Electronics; ComponentLink17Description: http://datasheet.octopart.com/CD4081BM-Texas-Instruments-datasheet-5254.pdf?src-supplier=Allied+Electronics; ComponentLink18URL: http://datasheet.octopart.com/CD4081BM-Texas-Instruments-datasheet-111545.pdf?src-supplier=Sierra+IC; ComponentLink18Description: http://datasheet.octopart.com/CD4081BM-Texas-Instruments-datasheet-111545.pdf?src-supplier=Sierra+IC; ComponentLink19URL: http://datasheet.octopart.com/CD4081BM-Texas-Instruments-datasheet-7596796.pdf?src-supplier=Jameco; ComponentLink19Description: http://datasheet.octopart.com/CD4081BM-Texas-Instruments-datasheet-7596796.pdf?src-supplier=Jameco; ComponentLink20URL: http://datasheet.octopart.com/CD4081BM-Texas-Instruments-datasheet-7626019.pdf?src-supplier=Farnell; ComponentLink20Description: http://datasheet.octopart.com/CD4081BM-Texas-Instruments-datasheet-7626019.pdf?src-supplier=Farnell; ComponentLink21URL: http://datasheet.octopart.com/CD4081BM-Texas-Instruments-datasheet-7628878.pdf?src-supplier=Farnell; ComponentLink21Description: http://datasheet.octopart.com/CD4081BM-Texas-Instruments-datasheet-7628878.pdf?src-supplier=Farnell; ComponentLink22URL: http://datasheet.octopart.com/CD4081BM-Texas-Instruments-datasheet-7547189.pdf?src-supplier=Farnell; ComponentLink22Description: http://datasheet.octopart.com/CD4081BM-Texas-Instruments-datasheet-7547189.pdf?src-supplier=Farnell; ComponentLink23URL: http://datasheet.octopart.com/CD4081BM-Texas-Instruments-datasheet-5327680.pdf?src-supplier=Farnell; ComponentLink23Description: http://datasheet.octopart.com/CD4081BM-Texas-Instruments-datasheet-5327680.pdf?src-supplier=Farnell; ComponentLink24URL: http://datasheet.octopart.com/CD4081BM-Texas-Instruments-datasheet-8703573.pdf?src-supplier=Farnell; ComponentLink24Description: http://datasheet.octopart.com/CD4081BM-Texas-Instruments-datasheet-8703573.pdf?src-supplier=Farnell; ComponentLink25URL: http://datasheet.octopart.com/CD4081BM-Texas-Instruments-datasheet-604431.pdf?src-supplier=Farnell; ComponentLink25Description: http://datasheet.octopart.com/CD4081BM-Texas-Instruments-datasheet-604431.pdf?src-supplier=Farnell; ComponentLink26URL: http://datasheet.octopart.com/CD4081BM-Texas-Instruments-datasheet-14147925.pdf?src-supplier=IIIC; ComponentLink26Description: http://datasheet.octopart.com/CD4081BM-Texas-Instruments-datasheet-14147925.pdf?src-supplier=IIIC; ComponentLink27URL: http://datasheet.octopart.com/CD4081BM-Texas-Instruments-datasheet-10549843.pdf?src-supplier=Factory+Futures; ComponentLink27Description: http://datasheet.octopart.com/CD4081BM-Texas-Instruments-datasheet-10549843.pdf?src-supplier=Factory+Futures; ComponentLink28URL: http://datasheet.octopart.com/CD4081BM-Texas-Instruments-datasheet-27379352.pdf?src-supplier=Newark; ComponentLink28Description: http://datasheet.octopart.com/CD4081BM-Texas-Instruments-datasheet-27379352.pdf?src-supplier=Newark
LED1-LED9 = led-150080RS75000: On a Reel of 4000, 2 V Red LED 2012 (0805) SMD, Wurth Elektronik WL-SMCW 150080RS75000; Manufacturer: Würth Elektronik; Luminous Intensity: 150mcd; Viewing Angle: 140°; Forward Voltage: 2V; Wavelength: 625nm; Lens Style: Clear; Forward Current: 30mA; Test Current: 20mA; Supplier 1: Mouser; Supplier Part Number 1: 710-150080RS75000; Manufacturer Part Number: 150080RS75000; Stock 1: 24117; Pricing 1: 1 = 0.18000, 10 = 0.17500, 25 = 0.17400, 50 = 0.16200, 100 = 0.13900, 250 = 0.12300 (USD); Mount: Surface Mount; Case/Package: 0805; Color: Red; Case Code (Metric): 2012; Case Code (Imperial): 0805; Min Operating Temperature: -40°C; Max Operating Temperature: 85°C; Package Quantity: 4000; Packaging: Tape and Reel; Dominant Wavelength: 625nm; Length: 2mm; Height: 0.7mm; Width: 1.25mm; REACH SVHC: Unknown; ComponentLink1URL: https://datasheet.ciiva.com/22656/150080rs75000-22656961.pdf?src-supplier=Element14; ComponentLink1Description: https://datasheet.ciiva.com/22656/150080rs75000-22656961.pdf?src-supplier=Element14; ComponentLink2URL: https://datasheet.ciiva.com/29279/759435-da-01-en-chipled-0805-w-kl-rot-150080rs75000-29279032.pdf?src-supplier=Conrad; ComponentLink2Description: https://datasheet.ciiva.com/29279/759435-da-01-en-chipled-0805-w-kl-rot-150080rs75000-29279032.pdf?src-supplier=Conrad; ComponentLink3URL: http://datasheet.octopart.com/150080RS75000-W%C3%BCrth-Elektronik-datasheet-15983792.pdf?src-supplier=Element14; ComponentLink3Description: http://datasheet.octopart.com/150080RS75000-W%C3%BCrth-Elektronik-datasheet-15983792.pdf?src-supplier=Element14; ComponentLink4URL: http://datasheet.octopart.com/150080RS75000-W%C3%BCrth-Elektronik-datasheet-41196443.pdf?src-supplier=Newark; ComponentLink4Description: http://datasheet.octopart.com/150080RS75000-W%C3%BCrth-Elektronik-datasheet-41196443.pdf?src-supplier=Newark
M1-M3 = 2N7002-7-F: Manufacturer: Diodes Inc.; Nominal Vgs: 2.5V; Max Power Dissipation: 300mW; Drain to Source Voltage (Vdss): 60V; Continuous Drain Current (ID): 115mA; Rise Time: 3ns; Rds On Max: 7.5R; Input Capacitance: 50pF; Number of Elements: 1; Drain to Source Breakdown Voltage: 70V; Gate to Source Voltage (Vgs): 20V; Fall Time: 5.6ns; Turn-Off Delay Time: 11ns; Turn-On Delay Time: 7ns; Power Dissipation: 540mW; Element Configuration: Single; Current: 115A; catagory: nmos; Supplier 1: Mouser; Supplier Part Number 1: 621-2N7002-F; Manufacturer Part Number: 2N7002-7-F; Stock 1: 2405582; Pricing 1: 1 = 0.10000, 10 = 0.03800, 100 = 0.02700, 1000 = 0.02700, 3000 = 0.02700, 9000 = 0.02500, 24000 = 0.02300, 45000 = 0.02000, 99000 = 0.01900 (USD); Mount: Surface Mount; Case/Package: SOT-23; Number of Pins: 3; Weight: 0.000282oz; Contact Plating: Tin; Min Operating Temperature: -55°C; Max Operating Temperature: 150°C; Packaging: Tape and Reel; Package Quantity: 3000; Dual Supply Voltage: 60V; Number of Channels: 1; Drain to Source Resistance: 7.5R; On-State Resistance: 7.5R; Threshold Voltage: 2.5V; Termination: SMD/SMT; Voltage Rating (DC): 60V; Current Rating: 115mA; Voltage: 60V; Length: 2.9mm; Height: 1mm; Width: 1.3mm; Radiation Hardening: No; REACH SVHC: No SVHC; Lead Free: Lead Free; ComponentLink1URL: https://datasheet.ciiva.com/3304/ds11303-3304385.pdf?src-supplier=Avnet; ComponentLink1Description: https://datasheet.ciiva.com/3304/ds11303-3304385.pdf?src-supplier=Avnet; ComponentLink2URL: https://datasheet.ciiva.com/15219/getdatasheetpartid-110059-15219667.pdf?src-supplier=Verical; ComponentLink2Description: https://datasheet.ciiva.com/15219/getdatasheetpartid-110059-15219667.pdf?src-supplier=Verical; ComponentLink3URL: https://datasheet.ciiva.com/49020/70437206-49020102.pdf?src-supplier=Allied+Electronics; ComponentLink3Description: https://datasheet.ciiva.com/49020/70437206-49020102.pdf?src-supplier=Allied+Electronics; ComponentLink4URL: https://datasheet.ciiva.com/22712/1915452-22712375.pdf?src-supplier=Element14; ComponentLink4Description: https://datasheet.ciiva.com/22712/1915452-22712375.pdf?src-supplier=Element14; ComponentLink5URL: https://datasheet.ciiva.com/1188/ds11303-1188363.pdf?src-supplier=Element14; ComponentLink5Description: https://datasheet.ciiva.com/1188/ds11303-1188363.pdf?src-supplier=Element14
O1-O3 = VOM618AT: VOM618AT DC Input Phototransistor Output Optocoupler, Surface Mount, 4-Pin SOP; Manufacturer: Vishay; Reverse Breakdown Voltage: 6V; Forward Voltage: 1.6V; Forward Current: 60mA; Max Power Dissipation: 170mW; Number of Channels: 1; Collector Emitter Voltage (VCEO): 80V; Rise Time: 6us; Collector Emitter Saturation Voltage: 400mV; Max Collector Current: 100mA; Fall Time: 29us; Isolation Voltage: 3.75kV; Current Transfer Ratio: 600%; catagory: optotransister; Supplier 1: Mouser; Supplier Part Number 1: 78-VOM618AT; Manufacturer Part Number: VOM618AT; Stock 1: 3046; Pricing 1: 1 = 0.78000, 10 = 0.58000, 100 = 0.40100, 500 = 0.32500, 1000 = 0.26000, 3000 = 0.26000 (USD); Mount: Surface Mount; Case/Package: SOP; Number of Pins: 4; Min Operating Temperature: -55°C; Max Operating Temperature: 110°C; Packaging: Tape and Reel; Package Quantity: 3000; Reverse Voltage (DC): 6V; Output Voltage: 80V; Output Current per Channel: 100mA; Max Input Current: 60mA; Number of Elements: 1; Power Dissipation: 170mW; Max Output Voltage: 80V; Input Current: 60mA; Collector Emitter Breakdown Voltage: 80V; Length: 4.4mm; Height: 2mm; Width: 3.85mm; Radiation Hardening: No; Lead Free: Lead Free; ComponentLink1URL: https://datasheet.ciiva.com/14809/vom618a-14809332.pdf?src-supplier=Arrow; ComponentLink1Description: https://datasheet.ciiva.com/14809/vom618a-14809332.pdf?src-supplier=Arrow; ComponentLink2URL: https://datasheet.ciiva.com/26941/getdatasheetpartid-641279-26941966.pdf?src-supplier=Verical; ComponentLink2Description: https://datasheet.ciiva.com/26941/getdatasheetpartid-641279-26941966.pdf?src-supplier=Verical; ComponentLink3URL: https://datasheet.ciiva.com/26121/vom618a-26121477.pdf?src-supplier=Avnet+Europe; ComponentLink3Description: https://datasheet.ciiva.com/26121/vom618a-26121477.pdf?src-supplier=Avnet+Europe; ComponentLink4URL: https://datasheet.ciiva.com/16388/vom618a-16388008.pdf?src-supplier=Future+Electronics; ComponentLink4Description: https://datasheet.ciiva.com/16388/vom618a-16388008.pdf?src-supplier=Future+Electronics; ComponentLink5URL: https://datasheet.ciiva.com/14079/vom618a-14079934.pdf?src-supplier=Digi-Key; ComponentLink5Description: https://datasheet.ciiva.com/14079/vom618a-14079934.pdf?src-supplier=Digi-Key; ComponentLink6URL: http://datasheet.octopart.com/VOM618AT-Vishay-datasheet-13041718.pdf?src-supplier=Future+Electronics; ComponentLink6Description: http://datasheet.octopart.com/VOM618AT-Vishay-datasheet-13041718.pdf?src-supplier=Future+Electronics; ComponentLink7URL: http://datasheet.octopart.com/VOM618AT-Vishay-datasheet-12559985.pdf?src-supplier=Future+Electronics; ComponentLink7Description: http://datasheet.octopart.com/VOM618AT-Vishay-datasheet-12559985.pdf?src-supplier=Future+Electronics; ComponentLink8URL: http://datasheet.octopart.com/VOM618AT-Vishay-Siliconix-datasheet-62309874.pdf?src-supplier=Allied+Electronics; ComponentLink8Description: http://datasheet.octopart.com/VOM618AT-Vishay-Siliconix-datasheet-62309874.pdf?src-supplier=Allied+Electronics